# Altium schematic sheet Camera.SchDoc
size A
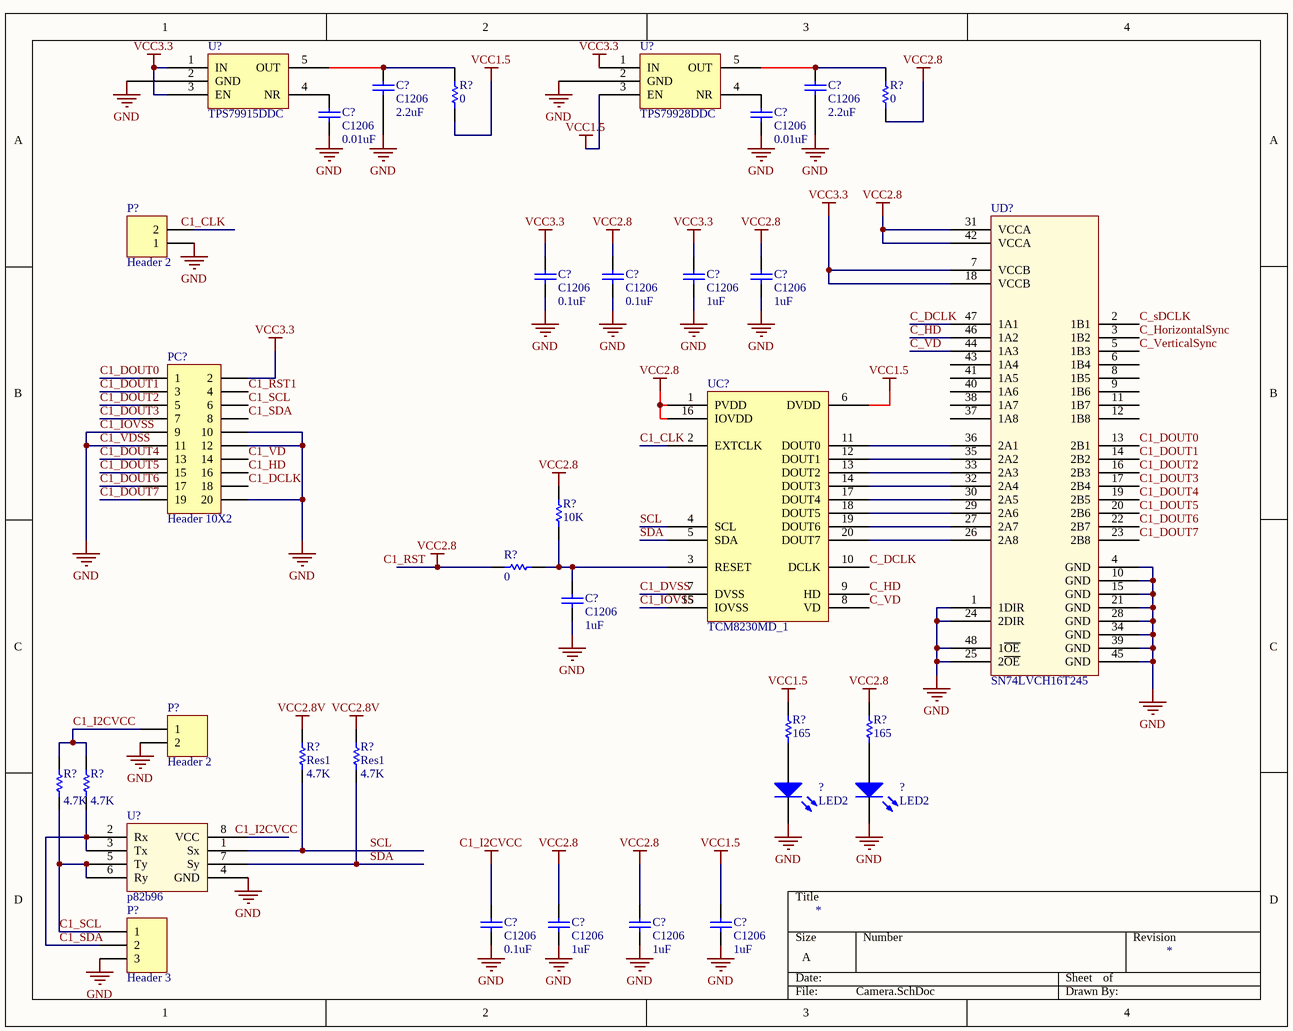
[diagram p0: Camera.SchDoc]

## Parts
(Parts that share a designator on the sheet are numbered #1, #2 ... from top to bottom, then left to right.)
?#1  LED2  [DIODE1608]
?#2  LED2  [DIODE1608]
C?#1  C1206  value 2.2uF  [1206]
C?#2  C1206  value 2.2uF  [1206]
C?#3  C1206  value 0.01uF  [1206]
C?#4  C1206  value 0.01uF  [1206]
C?#5  C1206  value 0.1uF  [1206]
C?#6  C1206  value 0.1uF  [1206]
C?#7  C1206  value 1uF  [1206]
C?#8  C1206  value 1uF  [1206]
C?#9  C1206  value 1uF  [1206]
C?#10  C1206  value 1uF  [1206]
C?#11  C1206  value 1uF  [1206]
C?#12  C1206  value 1uF  [1206]
C?#13  C1206  value 0.1uF  [1206]
P?#1  Header 2  [HDR1X2]
P?#2  Header 2  [HDR1X2]
P?#3  Header 3  [HDR1X3]
PC?  Header 10X2  [HDR2X10]
R?#1  0  [8-1206]
R?#2  0  [8-1206]
R?#3  10K  [8-1206]
R?#4  0  [8-1206]
R?#5  165  [8-1206]
R?#6  165  [8-1206]
R?#7  Res1  value 4.7K  [AXIAL-0.3]
R?#8  Res1  value 4.7K  [AXIAL-0.3]
R?#9  value 4.7K  [AXIAL-0.3]  (hidden comment: Res1)
R?#10  value 4.7K  [AXIAL-0.3]  (hidden comment: Res1)
U?#1  TPS79915DDC  [TSOT23-5]
U?#2  TPS79928DDC  [TSOT23-5]
U?#3  p82b96  [DIP-8]
UC?  TCM8230MD_1  [TCM8230MD]
UD?  SN74LVCH16T245  [SN74LVCH16T245]

## Nets
C1_I2CVCC: C?#13.2 P?#2.1 R?#9.2 R?#10.2
C1_IOVSS: ?#1.2(K) ?#2.2(K) C?#1.2 C?#2.2 C?#3.2 C?#4.1 C?#5.2 C?#6.2 C?#7.2 C?#8.2 C?#9.2 C?#10.2 C?#11.2 C?#12.2 C?#13.1 P?#1.1 P?#2.2 P?#3.3 PC?.9 PC?.10 PC?.11 PC?.12 PC?.20 U?#1.2(GND) U?#2.2(GND) U?#3.4(GND) UC?.15(IOVSS) UD?.1(1DIR) UD?.4(GND) UD?.10(GND) UD?.15(GND) UD?.21(GND) UD?.24(2DIR) UD?.25(2~{OE}) UD?.28(GND) UD?.34(GND) UD?.39(GND) UD?.45(GND) UD?.48(1~{OE})  [also labelled C1_VDSS, GND]
VCC1.5: C?#12.1 R?#1.2 R?#5.2 U?#2.3(EN) UC?.6(DVDD)
VCC2.8: C?#6.1 C?#8.1 C?#10.1 C?#11.1 R?#2.2 R?#3.2 R?#4.2 R?#6.2 UC?.1(PVDD) UC?.16(IOVDD) UD?.31(VCCA) UD?.42(VCCA)
VCC2.8V: R?#7.2 R?#8.2
VCC3.3: C?#5.1 C?#7.1 PC?.2 U?#1.1(IN) U?#1.3(EN) U?#2.1(IN) UD?.7(VCCB) UD?.18(VCCB)
C1_CLK: UC?.2(EXTCLK)
C1_DCLK: PC?.18
C1_DOUT0: PC?.1 UD?.13(2B1)
C1_DOUT1: PC?.3 UD?.14(2B2)
C1_DOUT2: PC?.5 UD?.16(2B3)
C1_DOUT3: PC?.7 UD?.17(2B4)
C1_DOUT4: PC?.13 UD?.19(2B5)
C1_DOUT5: PC?.15 UD?.20(2B6)
C1_DOUT6: PC?.17 UD?.22(2B7)
C1_DOUT7: PC?.19 UD?.23(2B8)
C1_DVSS: UC?.7(DVSS)
C1_HD: PC?.16
C1_RST1: PC?.4
C1_SCL: P?#3.1 PC?.6 R?#9.1 U?#3.5(Ty) U?#3.6(Ry)
C1_SDA: P?#3.2 PC?.8 R?#10.1 U?#3.2(Rx) U?#3.3(Tx)
C1_VD: PC?.14
C_DCLK: UC?.10(DCLK) UD?.47(1A1)
C_HD: UC?.9(HD) UD?.46(1A2)
C_HorizontalSync: UD?.3(1B2)
C_sDCLK: UD?.2(1B1)
C_VD: UC?.8(VD) UD?.44(1A3)
C_VerticalSync: UD?.5(1B3)
SCL: R?#7.1 U?#3.1(Sx) UC?.4(SCL)
SDA: R?#8.1 U?#3.7(Sy) UC?.5(SDA)
Net?#1_1: ?#1.1(A) R?#5.1
Net?#2_1: ?#2.1(A) R?#6.1
NetC?#1_1: C?#1.1 R?#1.1 U?#1.5(OUT)
NetC?#2_1: C?#2.1 R?#2.1 U?#2.5(OUT)
NetC?#3_1: C?#3.1 U?#2.4(NR)
NetC?#4_2: C?#4.2 U?#1.4(NR)
NetC?#9_1: C?#9.1 R?#3.1 R?#4.1 UC?.3(RESET)
NetUC?_11: UC?.11(DOUT0) UD?.36(2A1)
NetUC?_12: UC?.12(DOUT1) UD?.35(2A2)
NetUC?_13: UC?.13(DOUT2) UD?.33(2A3)
NetUC?_14: UC?.14(DOUT3) UD?.32(2A4)
NetUC?_17: UC?.17(DOUT4) UD?.30(2A5)
NetUC?_18: UC?.18(DOUT5) UD?.29(2A6)
NetUC?_19: UC?.19(DOUT6) UD?.27(2A7)
NetUC?_20: UC?.20(DOUT7) UD?.26(2A8)

Not connected (* = marked no-connect by the designer): P?#1 2; U?#3 8(VCC); UD? 6(1B4) 8(1B5) 9(1B6) 11(1B7) 12(1B8) 37(1A8) 38(1A7) 40(1A6) 41(1A5) 43(1A4)

## Notes on the sheet
- Labels drawn without touching a wire or pin: C1_CLK, C1_I2CVCC, C1_RST

## Library data of the parts
?#1 ?#2 = LED2: Typical RED, GREEN, YELLOW, AMBER GaAs LED; Published: 8-Jun-2000; LatestRevisionDate: 17-Jul-2002; LatestRevisionNote: Re-released for DXP Platform.; PackageVersion: Feb-2002; PackageReference: 3.2X1.6X1.1; Publisher: Altium Limited; Color: Blue
C?#1-C?#13 = C1206: Ceramic Chip Capacitor - Standard; Published: 17-Jul-2002; LatestRevisionDate: 19-Mar-2004; LatestRevisionNote: Silkscreen size reduced.; DatasheetDocument: Mar-2001; PackageDocument: Mar-2001; PackageReference: 1206; Publisher: Altium Limited; Code_JEITA: 1206; Code_IPC: 3216 [1206]; ComponentLink1Description: Manufacturer Link; ComponentLink1URL: http://www.kemet.com/; ComponentLink2Description: Datasheet; ComponentLink2URL: http://www.kemet.com/kemet/web/homepage/kechome.nsf/vapubfilesname/F3102TA.pdf/$file/F3102TA.pdf
P?#1 P?#2 = Header 2: Header, 2-Pin; LatestRevisionDate: 17-Jul-2002; LatestRevisionNote: Re-released for DXP Platform.; Publisher: Altium Limited
P?#3 = Header 3: Header, 3-Pin; LatestRevisionDate: 17-Jul-2002; LatestRevisionNote: Re-released for DXP Platform.; Publisher: Altium Limited
PC? = Header 10X2: Header, 10-Pin, Dual row; LatestRevisionDate: 17-Jul-2002; LatestRevisionNote: Re-released for DXP Platform.; Publisher: Altium Limited
R?#1-R?#4 = ERJ8GE: Thick Film Chip Resistor, 1 Ohm to 10M Ohm Range, 5% Tolerance, 1206 Size, 0.25 W; Note: If flow soldering, adjust pad width of PCB Footprint to 0.7 - 0.8 times the width of the resistor.; Published: 17-Dec-2003; LatestRevisionDate: 19-Mar-2004; LatestRevisionNote: Silkscreen size reduced.; PackageDocument: Mar-2003; PackageReference: 8-1206; Publisher: Altium Limited; Code_IPC: 3216 [1206]; ComponentLink1Description: Manufacturer Link; ComponentLink1URL: http://www.panasonic.com/industrial/components/resistive_products.htm; ComponentLink2Description: Datasheet; ComponentLink2URL: http://www.panasonic.com/industrial/components/pdf/AOA0000CE1.pdf
R?#5 R?#6 = ERJ8EN: Precision Thick Film Chip Resistor, 10 Ohm to 2.2M Ohm Range, 1% Tolerance, 1206 Size, 0.125 W; Published: 17-Dec-2003; LatestRevisionDate: 19-Mar-2004; LatestRevisionNote: Silkscreen size reduced.; PackageDocument: Mar-2003; PackageReference: 8-1206; Publisher: Altium Limited; Code_IPC: 3216 [1206]; ComponentLink1Description: Manufacturer Link; ComponentLink1URL: http://www.panasonic.com/industrial/components/resistive_products.htm; ComponentLink2Description: Datasheet; ComponentLink2URL: http://www.panasonic.com/industrial/components/pdf/AOA0000CE2.pdf
R?#7-R?#10 = Res1: Resistor; Published: 8-Jun-2000; LatestRevisionDate: 17-Jul-2002; LatestRevisionNote: Re-released for DXP Platform.; PackageReference: AXIAL-0.3; Publisher: Altium Limited
U?#1 U?#2 = TPS799xxDDC: 200mA, Low Quiescent Current, Ultra-Low Noise, High PSRR  Low Dropout Linear Regulator
UC? = TCM8230MD_1: VGA CAMERA MODULE 640x480
UD? = SN74LVCH16T245: 16-bit bus transceiver with voltage regulation.